# Altium project ESP32 Eval Board.PrjPcb
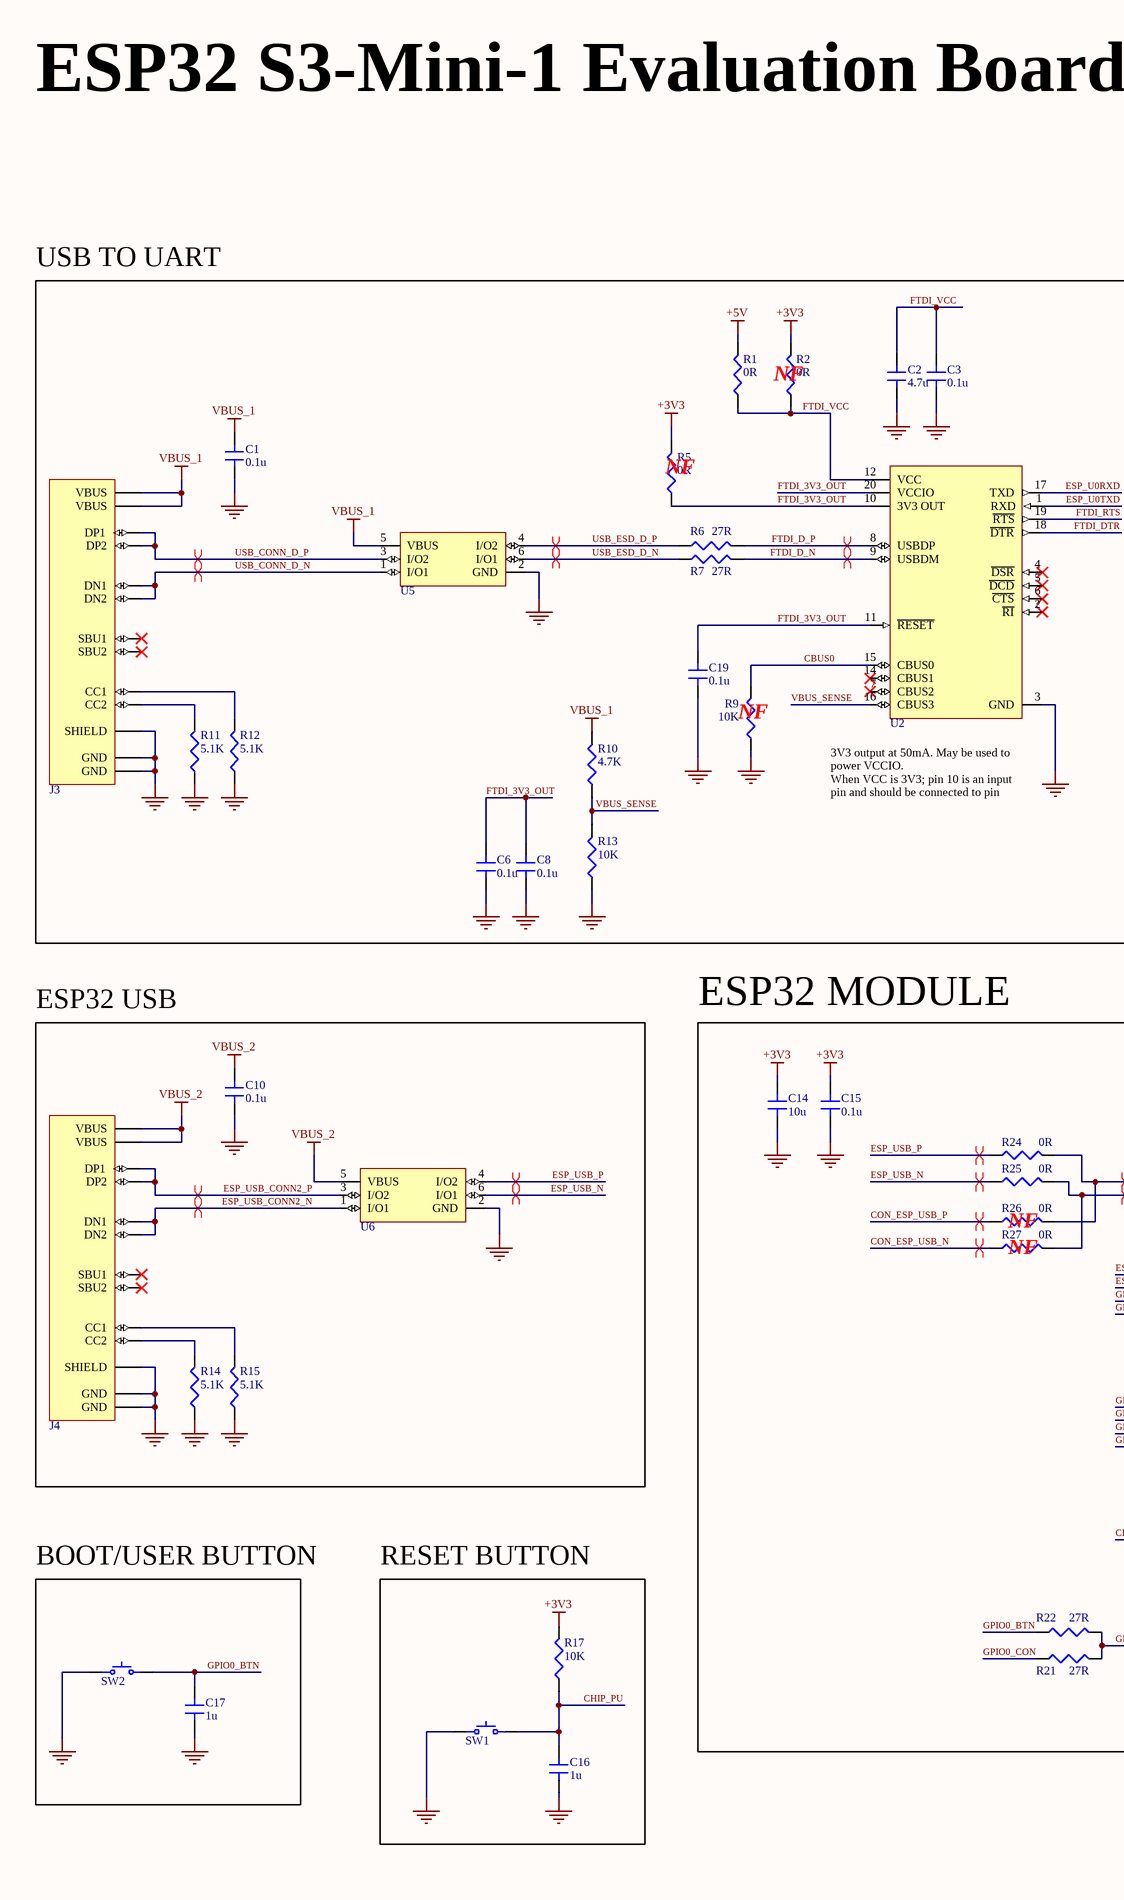
[diagram p0: ESP32 S3-Mini-1.SchDoc, left]
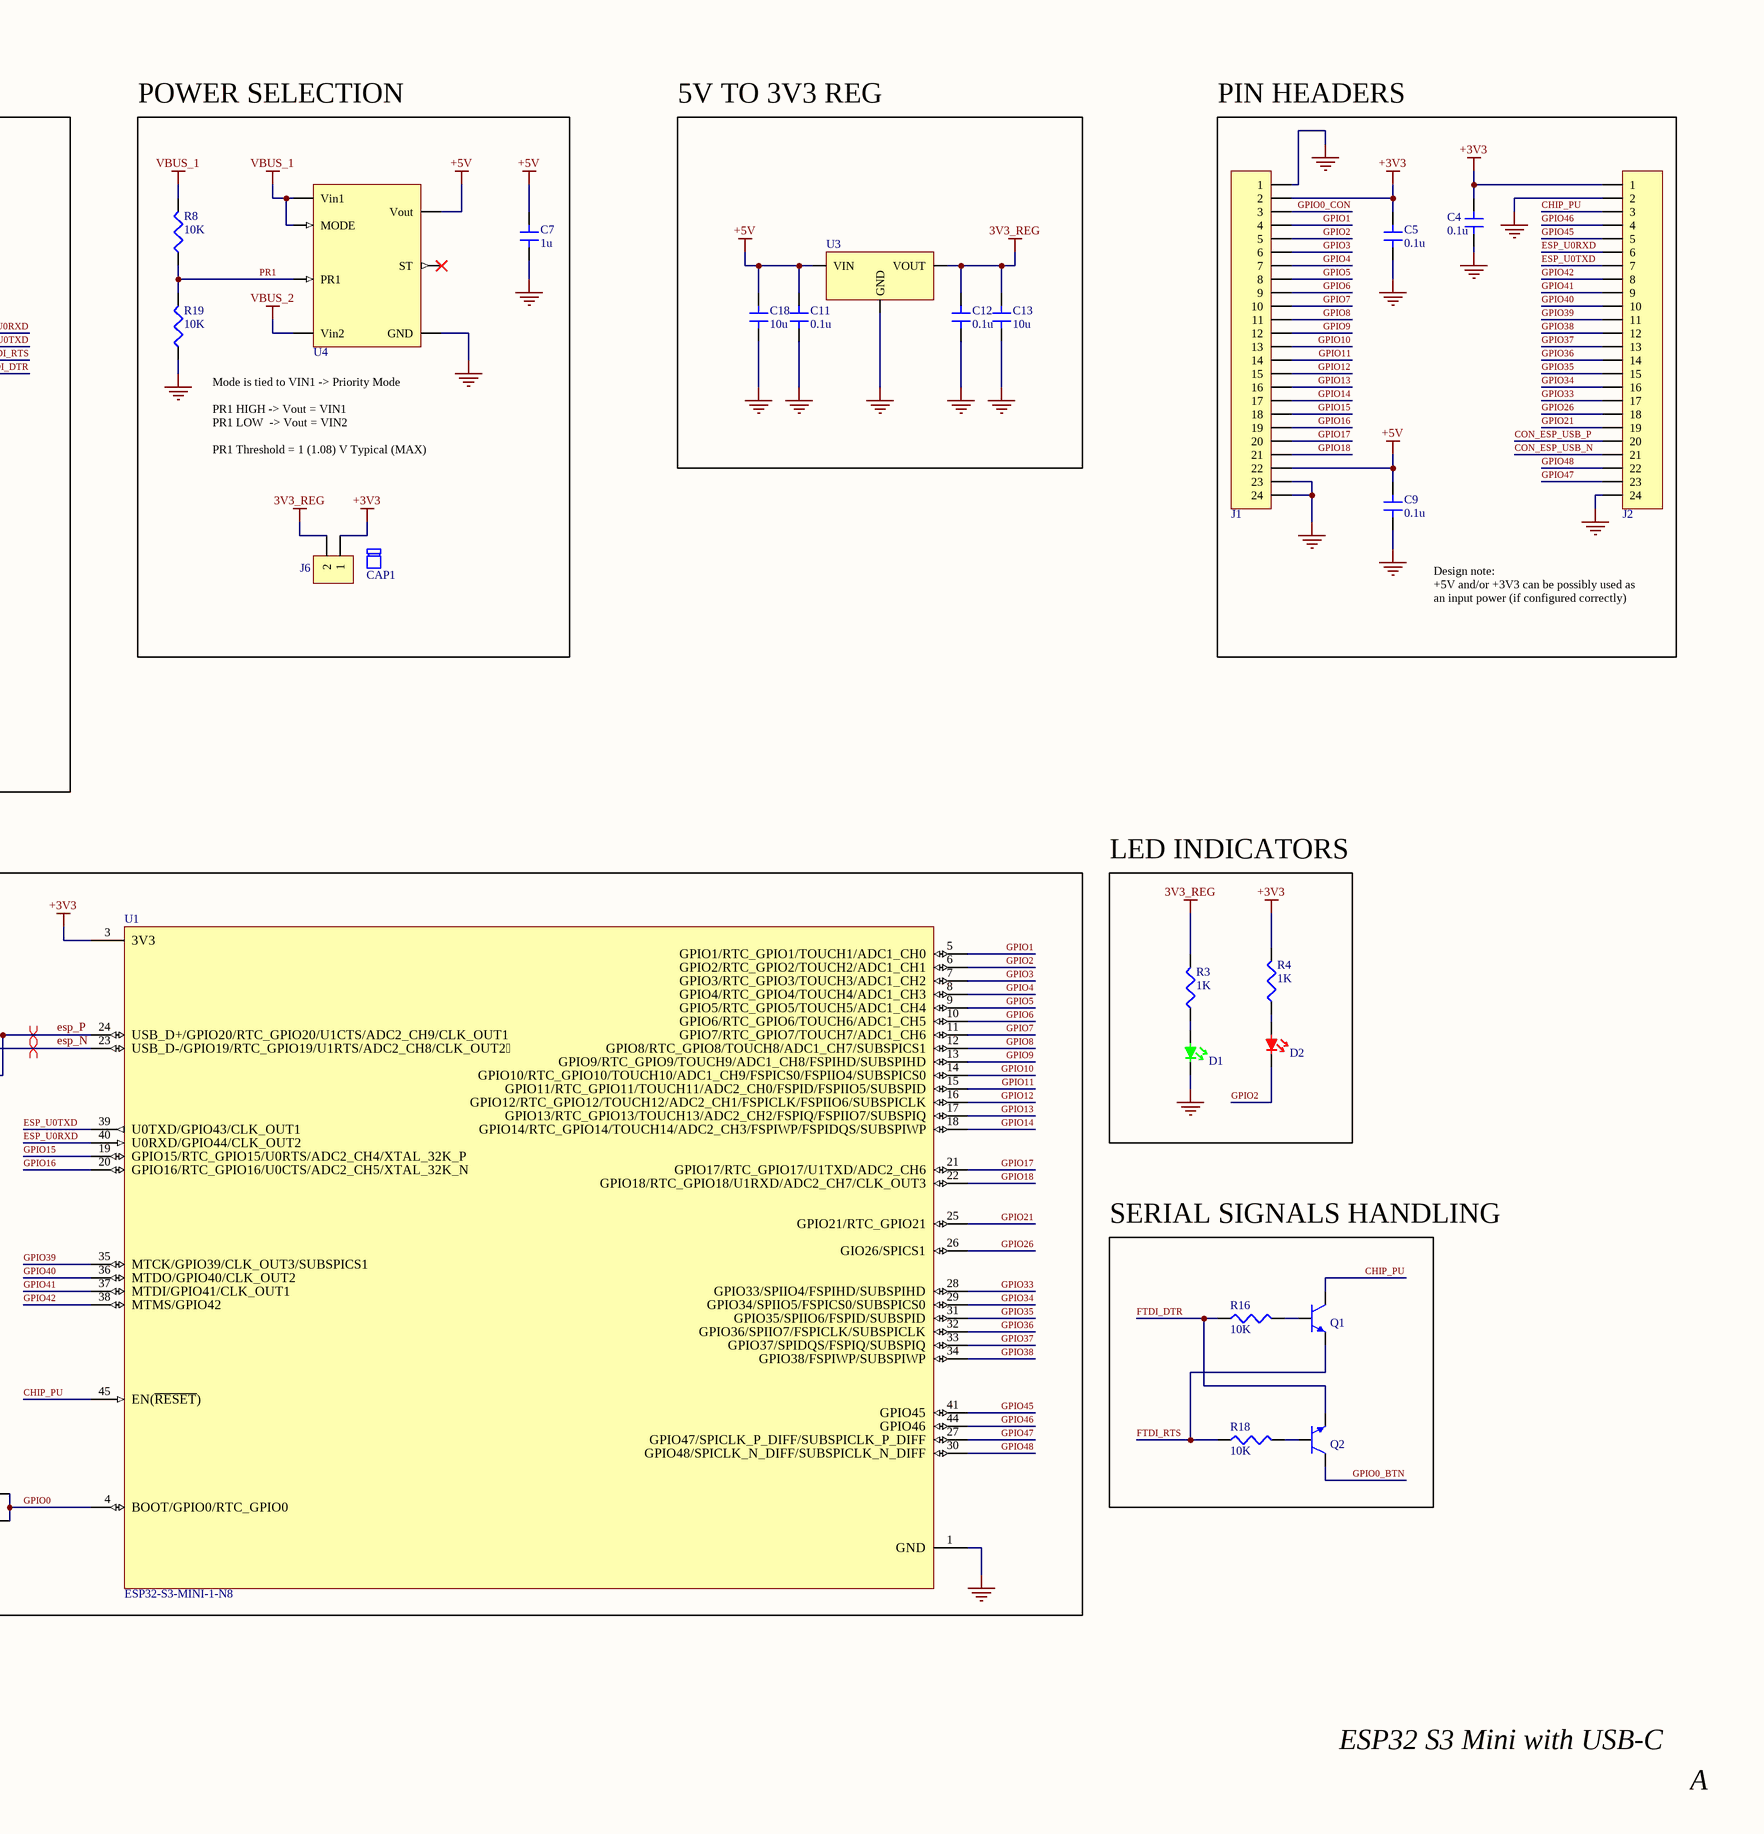
[diagram p1: ESP32 S3-Mini-1.SchDoc, right]
1 sheet, 62 parts. Net scope: global (net labels, ports and power ports of the same name join across sheets).
Board file: ESP32 S3 Mini-1.PcbDoc

## Sheet ESP32 S3-Mini-1.SchDoc
size A2; SheetNumber: 1; SheetTotal: 1

### Parts
C1  0.1u  [0603-CAP]
C2  4.7u  [0603-CAP]
C3  0.1u  [0603-CAP]
C4  0.1u  [0603-CAP]
C5  0.1u  [0603-CAP]
C6  0.1u  [0603-CAP]
C7  1u  [0603-CAP]
C8  0.1u  [0603-CAP]
C9  0.1u  [0603-CAP]
C10  0.1u  [0603-CAP]
C11  0.1u  [0603-CAP]
C12  0.1u  [0603-CAP]
C13  10u  [0603-CAP]
C14  10u  [0603-CAP]
C15  0.1u  [0603-CAP]
C16  1u  [0603-CAP]
C17  1u  [0603-CAP]
C18  10u  [0603-CAP]
C19  0.1u  [0603-CAP]
CAP1  Cap Jumper  (value not drawn)
D1  GREEN  [1206-LED green]  (value not drawn)
D2  RED  [1206-LED red]  (value not drawn)
J1  1x24P male Pinheaders  [1x24P male pinheader]  (value not drawn)
J2  1x24P male Pinheaders  [1x24P male pinheader]  (value not drawn)
J3  USB Type C connector  [USB-C]  (value not drawn)
J4  USB Type C connector  [USB-C]  (value not drawn)
J6  1x2P male Pinheaders  [1x2P male pinheader]  (value not drawn)
Q1  BJT Transistor  [SOT-23]  (value not drawn)
Q2  BJT Transistor  [SOT-23]  (value not drawn)
R1  0R  [0402-RES]
R2  0R  [0402-RES]
R3  1K  [0603-RES]
R4  1K  [0603-RES]
R5  0R  [0402-RES]
R6  27R  [0603-RES]
R7  27R  [0603-RES]
R8  10K  [0603-RES]
R9  10K  [0603-RES]
R10  4.7K  [0603-RES]
R11  5.1K  [0603-RES]
R12  5.1K  [0603-RES]
R13  10K  [0603-RES]
R14  5.1K  [0603-RES]
R15  5.1K  [0603-RES]
R16  10K  [0603-RES]
R17  10K  [0603-RES]
R18  10K  [0603-RES]
R19  10K  [0603-RES]
R21  27R  [0603-RES]
R22  27R  [0603-RES]
R24  0R  [0402-RES]
R25  0R  [0402-RES]
R26  0R  [0402-RES]
R27  0R  [0402-RES]
SW1  Tactile Switch  [Tactile Switch]  (value not drawn)
SW2  Tactile Switch  [Tactile Switch]  (value not drawn)
U1  ESP32-S3-MINI-1-N8  [ESP32-S3-MINI-1-N8]
U2  FTDI USB to UART  [QFN-20-EP(4x4)]  (value not drawn)
U3  3V3 LDO  [TO-252-2(DPAK)]  (value not drawn)
U4  Power Switchover  [SOT-583]  (value not drawn)
U5  3 Channels ESD Protection  [SOT-23-6]  (value not drawn)
U6  3 Channels ESD Protection  [SOT-23-6]  (value not drawn)

### Blocks framed on the sheet
USB TO UART: C1-C3 C6 C8 C19 J3 R1 R2 R5-R7 R9-R13 U2 U5
POWER SELECTION: C7 CAP1 J6 R8 R19 U4
5V TO 3V3 REG: C11-C13 C18 U3
PIN HEADERS: C4 C5 C9 J1 J2
ESP32 USB: C10 J4 R14 R15 U6
ESP32 MODULE: C14 C15 R21 R22 R24-R27 U1
LED INDICATORS: D1 D2 R3 R4
SERIAL SIGNALS HANDLING: Q1 Q2 R16 R18
BOOT/USER BUTTON: C17 SW2
RESET BUTTON: C16 R17 SW1

### Nets
3V3_REG: C12.2 C13.2 J6.2 R3.2 U3.3(VOUT)
+3V3: C4.2 C5.2 C14.2 C15.2 J1.2 J2.1 J6.1 R2.2 R4.2 R5.2 R17.2 U1.3(3V3)
+5V: C7.2 C9.2 C11.2 C18.2 J1.22 R1.2 U3.2(VIN) U4.2(Vout)
GND: C1.1 C2.1 C3.1 C4.1 C5.1 C6.1 C7.1 C8.1 C9.1 C10.1 C11.1 C12.1 C13.1 C14.1 C15.1 C16.1 C17.1 C18.1 C19.1 D1.2 J1.1 J1.23 J1.24 J2.2 J2.24 J3.A1/B12(GND) J3.B1/A12(GND) J3.SH(SHIELD) J4.A1/B12(GND) J4.B1/A12(GND) J4.SH(SHIELD) R9.1 R11.1 R12.1 R13.1 R14.1 R15.1 R19.1 SW1.1 SW2.1 U1.1(GND) U2.3(GND) U3.1(GND) U4.1(GND) U5.2(GND) U6.2(GND)
VBUS_1: C1.2 J3.A4/B9(VBUS) J3.B4/A9(VBUS) R8.2 R10.2 U4.3(Vin1) U4.5(MODE) U5.5(VBUS)
VBUS_2: C10.2 J4.A4/B9(VBUS) J4.B4/A9(VBUS) U4.6(Vin2) U6.5(VBUS)
CBUS0: R9.2 U2.15(CBUS0)
CHIP_PU: C16.2 J2.3 Q1.3 R17.1 SW1.2 U1.45(EN(~{RESET}))
CON_ESP_USB_N: J2.21 R27.1
CON_ESP_USB_P: J2.20 R26.1
esp_N: R25.2 R27.2 U1.23(USB_D-/GPIO19/RTC_GPIO19/U1RTS/ADC2_CH8/CLK_OUT2)
esp_P: R24.2 R26.2 U1.24(USB_D+/GPIO20/RTC_GPIO20/U1CTS/ADC2_CH9/CLK_OUT1)
ESP_U0RXD: J2.6 U1.40(U0RXD/GPIO44/CLK_OUT2) U2.17(TXD)
ESP_U0TXD: J2.7 U1.39(U0TXD/GPIO43/CLK_OUT1) U2.1(RXD)
ESP_USB_CONN2_N: J4.A7(DN1) J4.B7(DN2) U6.1(I/O1)
ESP_USB_CONN2_P: J4.A6(DP1) J4.B6(DP2) U6.3(I/O2)
ESP_USB_N: R25.1 U6.6(I/O1)
ESP_USB_P: R24.1 U6.4(I/O2)
FTDI_3V3_OUT: C6.2 C8.2 C19.2 R5.1 U2.10(3V3_OUT) U2.11(~{RESET}) U2.20(VCCIO)
FTDI_D_N: R7.2 U2.9(USBDM)
FTDI_D_P: R6.2 U2.8(USBDP)
FTDI_DTR: Q2.2 R16.1 U2.18(~{DTR})
FTDI_RTS: Q1.2 R18.1 U2.19(~{RTS})
FTDI_VCC: C2.2 C3.2 R1.1 R2.1 U2.12(VCC)
GPIO0: R21.2 R22.2 U1.4(BOOT/GPIO0/RTC_GPIO0)
GPIO0_BTN: C17.2 Q2.3 R22.1 SW2.2
GPIO0_CON: J1.3 R21.1
GPIO1: J1.4 U1.5(GPIO1/RTC_GPIO1/TOUCH1/ADC1_CH0)
GPIO2: D2.2 J1.5 U1.6(GPIO2/RTC_GPIO2/TOUCH2/ADC1_CH1)
GPIO3: J1.6 U1.7(GPIO3/RTC_GPIO3/TOUCH3/ADC1_CH2)
GPIO4: J1.7 U1.8(GPIO4/RTC_GPIO4/TOUCH4/ADC1_CH3)
GPIO5: J1.8 U1.9(GPIO5/RTC_GPIO5/TOUCH5/ADC1_CH4)
GPIO6: J1.9 U1.10(GPIO6/RTC_GPIO6/TOUCH6/ADC1_CH5)
GPIO7: J1.10 U1.11(GPIO7/RTC_GPIO7/TOUCH7/ADC1_CH6)
GPIO8: J1.11 U1.12(GPIO8/RTC_GPIO8/TOUCH8/ADC1_CH7/SUBSPICS1)
GPIO9: J1.12 U1.13(GPIO9/RTC_GPIO9/TOUCH9/ADC1_CH8/FSPIHD/SUBSPIHD)
GPIO10: J1.13 U1.14(GPIO10/RTC_GPIO10/TOUCH10/ADC1_CH9/FSPICS0/FSPIIO4/SUBSPICS0)
GPIO11: J1.14 U1.15(GPIO11/RTC_GPIO11/TOUCH11/ADC2_CH0/FSPID/FSPIIO5/SUBSPID)
GPIO12: J1.15 U1.16(GPIO12/RTC_GPIO12/TOUCH12/ADC2_CH1/FSPICLK/FSPIIO6/SUBSPICLK)
GPIO13: J1.16 U1.17(GPIO13/RTC_GPIO13/TOUCH13/ADC2_CH2/FSPIQ/FSPIIO7/SUBSPIQ)
GPIO14: J1.17 U1.18(GPIO14/RTC_GPIO14/TOUCH14/ADC2_CH3/FSPIWP/FSPIDQS/SUBSPIWP)
GPIO15: J1.18 U1.19(GPIO15/RTC_GPIO15/U0RTS/ADC2_CH4/XTAL_32K_P)
GPIO16: J1.19 U1.20(GPIO16/RTC_GPIO16/U0CTS/ADC2_CH5/XTAL_32K_N)
GPIO17: J1.20 U1.21(GPIO17/RTC_GPIO17/U1TXD/ADC2_CH6)
GPIO18: J1.21 U1.22(GPIO18/RTC_GPIO18/U1RXD/ADC2_CH7/CLK_OUT3)
GPIO21: J2.19 U1.25(GPIO21/RTC_GPIO21)
GPIO26: J2.18 U1.26(GIO26/SPICS1)
GPIO33: J2.17 U1.28(GPIO33/SPIIO4/FSPIHD/SUBSPIHD)
GPIO34: J2.16 U1.29(GPIO34/SPIIO5/FSPICS0/SUBSPICS0)
GPIO35: J2.15 U1.31(GPIO35/SPIIO6/FSPID/SUBSPID)
GPIO36: J2.14 U1.32(GPIO36/SPIIO7/FSPICLK/SUBSPICLK)
GPIO37: J2.13 U1.33(GPIO37/SPIDQS/FSPIQ/SUBSPIQ)
GPIO38: J2.12 U1.34(GPIO38/FSPIWP/SUBSPIWP)
GPIO39: J2.11 U1.35(MTCK/GPIO39/CLK_OUT3/SUBSPICS1)
GPIO40: J2.10 U1.36(MTDO/GPIO40/CLK_OUT2)
GPIO41: J2.9 U1.37(MTDI/GPIO41/CLK_OUT1)
GPIO42: J2.8 U1.38(MTMS/GPIO42)
GPIO45: J2.5 U1.41(GPIO45)
GPIO46: J2.4 U1.44(GPIO46)
GPIO47: J2.23 U1.27(GPIO47/SPICLK_P_DIFF/SUBSPICLK_P_DIFF)
GPIO48: J2.22 U1.30(GPIO48/SPICLK_N_DIFF/SUBSPICLK_N_DIFF)
PR1: R8.1 R19.2 U4.4(PR1)
USB_CONN_D_N: J3.A7(DN1) J3.B7(DN2) U5.1(I/O1)
USB_CONN_D_P: J3.A6(DP1) J3.B6(DP2) U5.3(I/O2)
USB_ESD_D_N: R7.1 U5.6(I/O1)
USB_ESD_D_P: R6.1 U5.4(I/O2)
VBUS_SENSE: R10.1 R13.2 U2.16(CBUS3)
NetD1_1: D1.1 R3.1
NetD2_1: D2.1 R4.1
NetJ3_A5: J3.A5(CC1) R12.2
NetJ3_B5: J3.B5(CC2) R11.2
NetJ4_A5: J4.A5(CC1) R15.2
NetJ4_B5: J4.B5(CC2) R14.2
NetQ1_1: Q1.1 R16.2
NetQ2_1: Q2.1 R18.2

Not connected (* = marked no-connect by the designer): J3 A8(SBU1)* B8(SBU2)*; J4 A8(SBU1)* B8(SBU2)*; U2 2(~{RI})* 4(~{DSR})* 5(~{DCD})* 6(~{CTS})* 7(CBUS2)* 14(CBUS1)*; U4 8(ST)*

### Layout directives
differential pair; differential pair class DIFF90: CON_ESP_USB_N, CON_ESP_USB_P, esp_N, esp_P, ESP_USB_CONN2_N, ESP_USB_CONN2_P, ESP_USB_N, ESP_USB_P, FTDI_D_N, FTDI_D_P, USB_CONN_D_N, USB_CONN_D_P, USB_ESD_D_N, USB_ESD_D_P

### Notes on the sheet
- ESP32 S3-Mini-1 Evaluation Board
- (near R2) NF
- (near R5) NF
- Mode is tied to VIN1 -> Priority Mode
  PR1 HIGH -> Vout = VIN1
  PR1 LOW  -> Vout = VIN2
  PR1 Threshold = 1 (1.08) V Typical (MAX)
- (near R9) NF
- Design note:
  +5V and/or +3V3 can be possibly used as an input power (if configured correctly)
- (near U2) 3V3 output at 50mA. May be used to power VCCIO.
  When VCC is 3V3; pin 10 is an input pin and should be connected to pin 12.
- (near R26) NF
- (near R27) NF
- ESP32 S3 Mini with USB-C
- A

### Library data of the parts
C1 C3-C6 C8-C12 C15 C19 = CAP 0.1uF: 50V 100nF X7R ±5% 0603 Multilayer Ceramic Capacitors MLCC - SMD/SMT ROHS; Manufacturer: YAGEO; Mfr. Part #: CC0603JRX7R9BB104; Supplier: LCSC ELECTRONICS; Supplier Part #: C91183; Package: 0603
C2 = CAP 4.7uF: 16V 4.7uF X5R ±10% 0603 Multilayer Ceramic Capacitors MLCC - SMD/SMT ROHS; Manufacturer: Samsung Electro-Mechanics; Mfr. Part #: CL10A475KO8NNNC; Supplier: LCSC ELECTRONICS; Supplier Part #: C19666; Package: 0603
C7 C16 C17 = CAP 1uF: 16V 1uF X7R ±5% 0603 Multilayer Ceramic Capacitors MLCC - SMD/SMT ROHS; Manufacturer: YAGEO; Mfr. Part #: CC0603JRX7R7BB105; Supplier: LCSC ELECTRONICS; Supplier Part #: C519560; Package: 0603
C13 C14 C18 = CAP 10uF: 16V 10uF X5R ±10% 0603 Multilayer Ceramic Capacitors MLCC - SMD/SMT ROHS; Manufacturer: Samsung Electro-Mechanics; Mfr. Part #: CL10A106KO8NQNC; Supplier: LCSC ELECTRONICS; Supplier Part #: C962136; Package: 0603
CAP1 = Cap Jumper: Open top 3A 2.54mm P=2.54mm Shunts, Jumpers ROHS; Manufacturer: BOOMELE(Boom Precision Elec); Mfr. Part #: 2.54; Supplier: LCSC ELECTRONICS; Supplier Part #: C5305; Package: P=2.54mm
D1 = LED GREEN: 25mA Colorless transparent lens 516nm~525nm -30℃~+85℃ Positive Stick Emerald 120° 80mW 1206 LED Indication - Discrete ROHS; Manufacturer: XINGLIGHT; Mfr. Part #: XL-3216UGC; Supplier: LCSC ELECTRONICS; Supplier Part #: C965825; Package: 1206
D2 = LED RED: 20mA 225mcd Colorless and transparent -20℃~+85℃ Positive Stick 615nm~630nm Red 120° 50mW 2.4V 1206 LED Indication - Discrete ROHS; Manufacturer: XINGLIGHT; Mfr. Part #: XL-3216SURC; Supplier: LCSC ELECTRONICS; Supplier Part #: C965822; Package: 1206
J1 J2 = 1x24P male Pinheaders: Gold 250V 3A Policy 2.5mm 24P 260℃ -40℃~+105℃ 2.54mm Single Row Black Brass 2.54mm 1x24P Plugin,P=2.54mm Pin Headers ROHS; Manufacturer: XKB Connection; Mfr. Part #: X6511WV-24H-C60D30; Supplier: LCSC ELECTRONICS; Supplier Part #: C725956; Package: Plugin,P=2.54mm
J3 J4 = USB Type C connector: 5A 1 16P Female Type-C SMD USB Connectors ROHS; Manufacturer: Korean Hroparts Elec; Mfr. Part #: TYPE-C-31-M-12; Supplier: LCSC ELECTRONICS; Supplier Part #: C165948; Package: SMD
J6 = 1x2P male Pinheaders: 3A Direct Insert Policy 2.54mm 2P 6mm 3mm 2.54mm Single Row 1x2P Plugin,P=2.54mm Pin Headers ROHS; Manufacturer: DEALON; Mfr. Part #: DZ254R-11-02-63; Supplier: LCSC ELECTRONICS; Supplier Part #: C2935908; Package: Plugin,P=2.54mm
Q1 Q2 = BJT Transistor: 25V 300mW 120@100mA,1V 1.5A NPN SOT-23 Bipolar (BJT) ROHS; Manufacturer: Jiangsu Changjing Electronics Technology Co., Ltd.; Mfr. Part #: SS8050-G(RANGE:120-200); Supplier: LCSC ELECTRONICS; Supplier Part #: C164886; Package: SOT-23
R1 R2 R5 R24-R27 = Resistor 0R: 62.5mW Thick Film Resistors 50V ±800ppm/℃ ±1% 0Ω 0402 Chip Resistor - Surface Mount ROHS; Manufacturer: UNI-ROYAL(Uniroyal Elec); Mfr. Part #: 0402WGF0000TCE; Supplier: LCSC ELECTRONICS; Supplier Part #: C17168; Package: 0402
R3 R4 = Resistor 1K: 100mW Thick Film Resistors 75V ±100ppm/℃ ±1% 1kΩ 0603 Chip Resistor - Surface Mount ROHS; Manufacturer: UNI-ROYAL(Uniroyal Elec); Mfr. Part #: 0603WAF1001T5E; Supplier: LCSC ELECTRONICS; Supplier Part #: C21190; Package: 0603
R6 R7 R21 R22 = Resistor 27R: 100mW Thick Film Resistors 75V ±1% ±200ppm/℃ 27Ω 0603 Chip Resistor - Surface Mount ROHS; Manufacturer: UNI-ROYAL(Uniroyal Elec); Mfr. Part #: 0603WAF270JT5E; Supplier: LCSC ELECTRONICS; Supplier Part #: C25190; Package: 0603
R8 R9 R13 R16-R19 = Resistor 10K: 100mW Thick Film Resistors 75V ±100ppm/℃ ±1% 10kΩ 0603 Chip Resistor - Surface Mount ROHS; Manufacturer: UNI-ROYAL(Uniroyal Elec); Mfr. Part #: 0603WAF1002T5E; Supplier: LCSC ELECTRONICS; Supplier Part #: C25804; Package: 0603
R10 = Resistor 4.7K: 100mW Thick Film Resistors 75V ±100ppm/℃ ±1% 4.7kΩ 0603 Chip Resistor - Surface Mount ROHS; Manufacturer: UNI-ROYAL(Uniroyal Elec); Mfr. Part #: 0603WAF4701T5E; Supplier: LCSC ELECTRONICS; Supplier Part #: C23162; Package: 0603
R11 R12 R14 R15 = Resistor 5.1K: 100mW Thick Film Resistors 75V ±100ppm/℃ ±5% 5.1kΩ 0603 Chip Resistor - Surface Mount ROHS; Manufacturer: UNI-ROYAL(Uniroyal Elec); Mfr. Part #: 0603WAJ0512T5E; Supplier: LCSC ELECTRONICS; Supplier Part #: C26000; Package: 0603
SW1 SW2 = Tactile Switch: 50mA 5.1mm 100,000 Times 160gf 12V 5.1mm 1.5mm Round Button Vertical welding SPST SMD Tactile Switches ROHS; Manufacturer: XKB Connection; Mfr. Part #: TS-1187A-B-A-B; Supplier: LCSC ELECTRONICS; Supplier Part #: C318884; Package: SMD
U1 = ESP32-S3-MINI: 20.5dBm ESP32-S3FN8 chip 2.4GHz SMD-41P WiFi Modules ROHS; Manufacturer: Espressif Systems; Mfr. Part #: ESP32-S3-MINI-1-N8; Supplier: LCSC ELECTRONICS; Supplier Part #: C2913206; Package: SMD-41P
U2 = FTDI USB to UART: USB to UART UART QFN-20-EP(4x4) USB Converters ROHS; Mfr. Part #: FT231XQ-R; Manufacturer: FTDI; Supplier: LCSC ELECTRONICS; Supplier Part #: C132159; Package: QFN-20-EP(4x4)
U3 = 3V3 LDO: 79dB@(120Hz) 1.5A Fixed 3.3V Positive electrode 30V TO-252-2(DPAK) Voltage Regulators - Linear, Low Drop Out (LDO) Regulators ROHS; Manufacturer: STMicroelectronics; Mfr. Part #: LD1086DT33TR; Supplier: LCSC ELECTRONICS; Supplier Part #: C12051; Package: TO-252-2(DPAK)
U4 = Power Switchover: 1.6V~5.5V 42mΩ 2.5A 1 SOT-583 Power Distribution Switches ROHS; Manufacturer: Texas Instruments; Mfr. Part #: TPS2116DRLR; Supplier: LCSC ELECTRONICS; Supplier Part #: C3235557; Package: SOT-583
U5 U6 = 3 Channels ESD Protection: 5A 17V 6V Unidirectional 5.25V SOT-23-6 Electrostatic and Surge Protection (TVS/ESD) ROHS; Manufacturer: STMicroelectronics; Mfr. Part #: USBLC6-2SC6; Supplier: LCSC; Supplier Part #: C7519; Package: SOT-23-6